# EAGLE schematic USB-C PD (EAGLE 9.2.1)
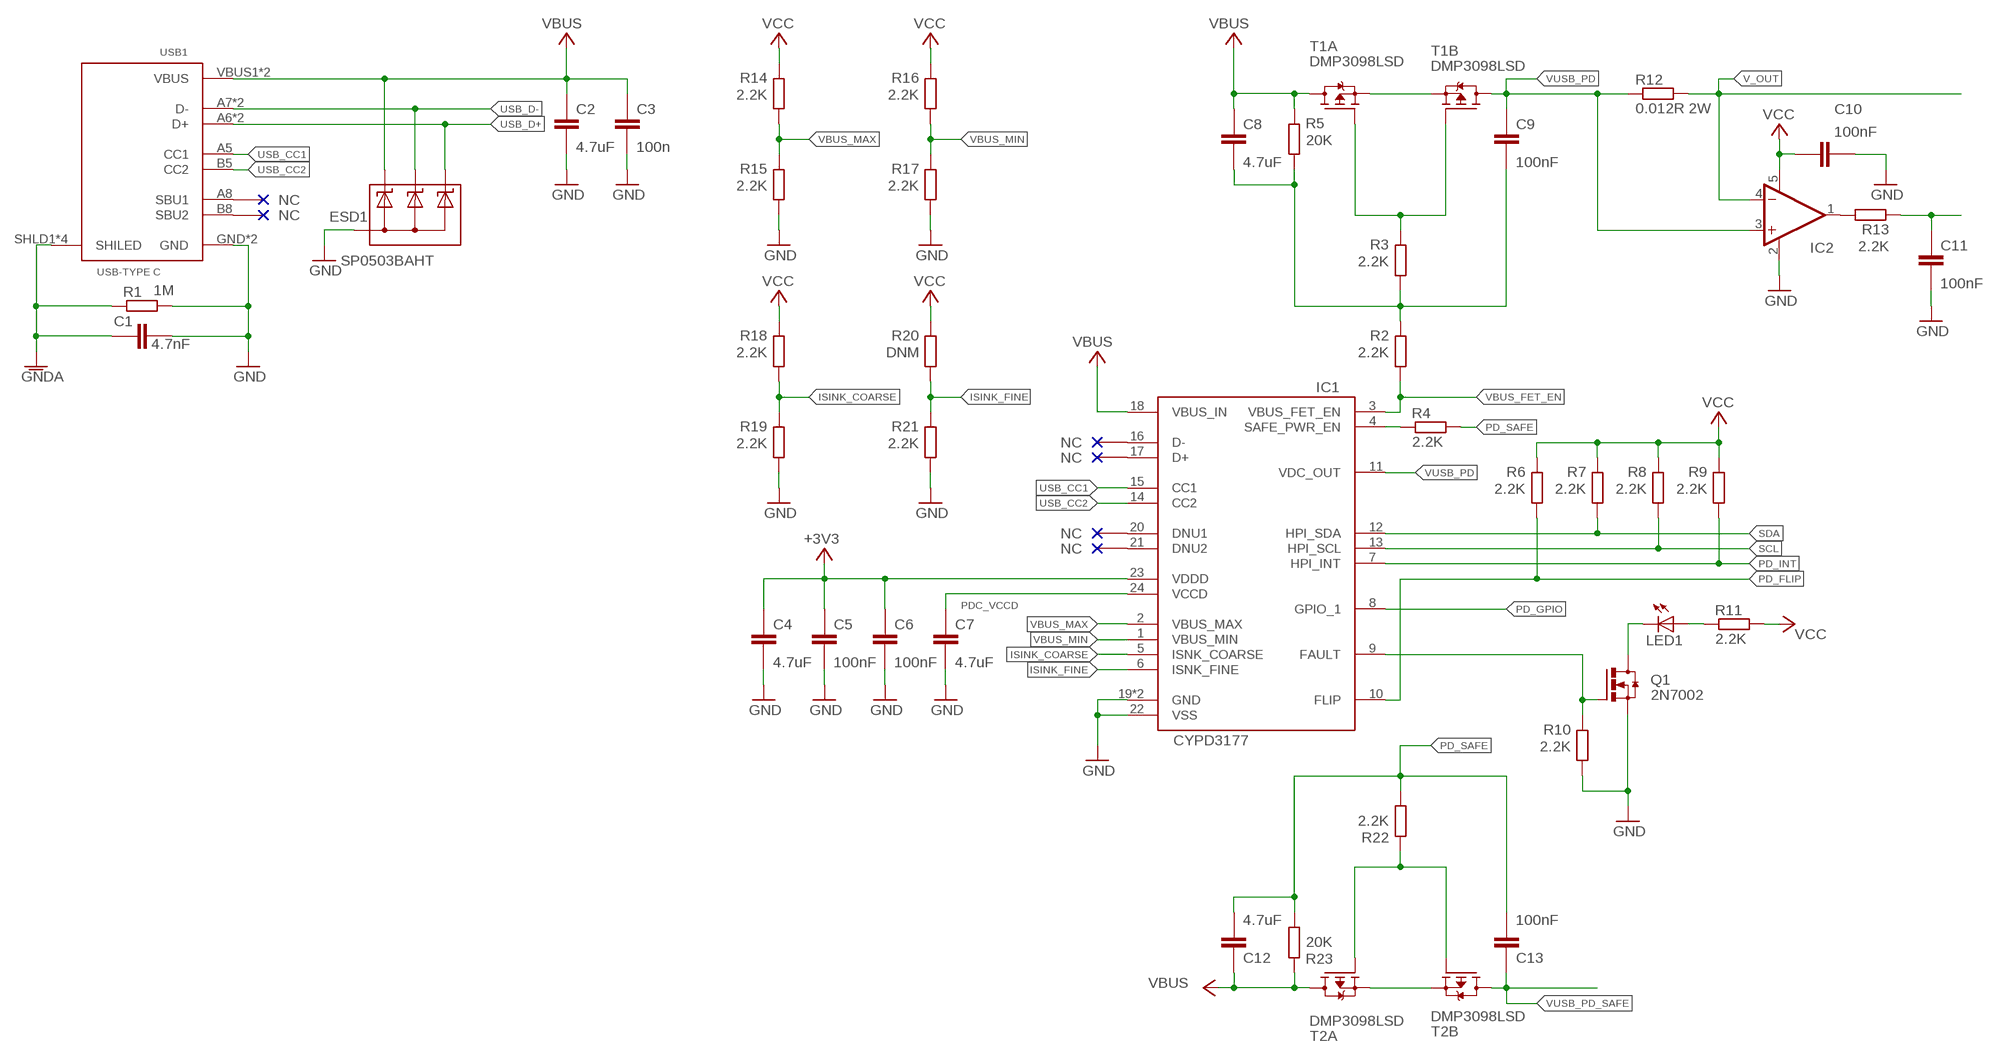
[diagram p0: schematic, sheet 1]

## Parts
C1  4.7nF  C0402  [0402]
C2  4.7uF  C0603  [0603]
C3  100n  C0603  [0603]
C4  4.7uF  C0603  [0603]
C5  100nF  C0402  [0402]
C6  100nF  C0402  [0402]
C7  4.7uF  C0603  [0603]
C8  4.7uF  C0603  [0603]
C9  100nF  C0402  [0402]
C10  100nF  C0402  [0402]
C11  100nF  C0402  [0402]
C12  4.7uF  C0603  [0603]
C13  100nF  C0402  [0402]
ESD1  SP0503BAHT  [SOT143]
IC1  CYPD3177-24LQXQ  [QFN50P400X400X60-25T275N]
IC2  INA180A3-IDBVR  [SOT23-5]
LED1  LEDCHIP-LED0805  [CHIP-LED0805]
Q1  2N7002  2N7002,215  [SOT23-3]
R1  1M  R0402  [0402]
R2  2.2K  R0402  [0402]
R3  2.2K  R0402  [0402]
R4  2.2K  R0402  [0402]
R5  20K  R0402  [0402]
R6  2.2K  R0402  [0402]
R7  2.2K  R0402  [0402]
R8  2.2K  R0402  [0402]
R9  2.2K  R0402  [0402]
R10  2.2K  R0402  [0402]
R11  2.2K  R0402  [0402]
R12  0.012R 2W  R-EU_R2512  [R2512]
R13  2.2K  R0402  [0402]
R14  2.2K  R0402  [0402]
R15  2.2K  R0402  [0402]
R16  2.2K  R0402  [0402]
R17  2.2K  R0402  [0402]
R18  2.2K  R0402  [0402]
R19  2.2K  R0402  [0402]
R20  DNM  R0402  [0402]
R21  2.2K  R0402  [0402]
R22  2.2K  R0402  [0402]
R23  20K  R0402  [0402]
T1  DMP3098LSD  DMP3098-LSD-13  [SO8]
T2  DMP3098LSD  DMP3098-LSD-13  [SO8]
USB1  USB_C  [USBC]

## Nets
+3V3: C4.1 C5.1 C6.1 IC1.23(VDDD)
GND: C1.1 C2.2 C3.2 C4.2 C5.2 C6.2 C7.2 C10.2 C11.2 ESD1.1(A) IC1.19(GND) IC1.22(VSS) IC1.25(GND) IC2.2(V-) Q1.2(S) R1.1 R10.1 R15.1 R17.1 R19.1 R21.1 USB1.GND USB1.GND2(GND)
GNDA: C1.2 R1.2 USB1.SHLD1(SHILED) USB1.SHLD2(SHILED) USB1.SHLD5(SHILED) USB1.SHLD8(SHILED)
ISINK_COARSE: IC1.5(ISNK_COARSE) R18.1 R19.2
ISINK_FINE: IC1.6(ISNK_FINE) R20.1 R21.2
N$1: R3.2 T1.2(A:G) T1.4(B:G)
N$2: IC1.4(SAFE_PWR_EN) R4.1
N$3: IC2.1(OUT) R13.2
N$4: C8.2 C9.2 R2.2 R3.1 R5.1
N$5 [Power]: T1.1(A:S) T1.3(B:S)
N$6: C11.1 R13.1
N$7: IC1.9(FAULT) Q1.1(G) R10.2
N$8: LED1.A R11.2
N$9: LED1.C Q1.3(D)
N$11: R22.2 T2.2(A:G) T2.4(B:G)
N$12 [Power]: T2.1(A:S) T2.3(B:S)
PD_FLIP: IC1.10(FLIP) R6.1
PD_GPIO: IC1.8(GPIO_1)
PD_INT: IC1.7(HPI_INT) R9.1
PD_SAFE: C12.2 C13.2 R4.2 R22.1 R23.1
PDC_VCCD: C7.1 IC1.24(VCCD)
SCL: IC1.13(HPI_SCL) R8.1
SDA: IC1.12(HPI_SDA) R7.1
USB_CC1: IC1.15(CC1) USB1.A5(CC1)
USB_CC2: IC1.14(CC2) USB1.B5(CC2)
USB_D+: ESD1.4(C3) USB1.A6(D+) USB1.B6(D+)
USB_D-: ESD1.3(C2) USB1.A7(D-) USB1.B7(D-)
V_OUT [Power]: IC2.4(-IN) R12.2
VBUS [Power]: C2.1 C3.1 C8.1 C12.1 ESD1.2(C1) IC1.18(VBUS_IN) R5.2 R23.2 T1.7(A:D) T1.8(A:D) T2.7(A:D) T2.8(A:D) USB1.VBUS1(VBUS) USB1.VBUS2(VBUS)
VBUS_FET_EN: IC1.3(VBUS_FET_EN) R2.1
VBUS_MAX: IC1.2(VBUS_MAX) R14.1 R15.2
VBUS_MIN: IC1.1(VBUS_MIN) R16.1 R17.2
VCC: C10.1 IC2.5(V+) R6.2 R7.2 R8.2 R9.2 R11.1 R14.2 R16.2 R18.2 R20.2
VUSB_PD [Power]: C9.1 IC1.11(VDC_OUT) IC2.3(+IN) R12.1 T1.5(B:D) T1.6(B:D)
VUSB_PD_SAFE [Power]: C13.1 T2.5(B:D) T2.6(B:D)
Unconnected: IC1.16(D-) IC1.17(D+) IC1.20(DNU1) IC1.21(DNU2) USB1.A8(SBU1) USB1.B8(SBU2)

## Library data of the parts
C1-C13 = ds_passive:C
ESD1 = ds_ic_peripherals:SP0503BAHT: TVS Diode Arrays Surface Mount TVS Avalanche Diode Array
IC1 = ds_ic_vreg:CYPD3177: USB Type-C Port Controller for Power Sinks EZ-PD™ BCR is Cypress’ highly-integrated pre-programmed USB Type-C port controller targeting electronic devices that have legacy barrel connectors (up to 100W) or USB micro-B connectors for power such as drones, smart speakers, power tools, and other rechargeable devices. EZ-PD BCR complies with the latest USB Type-C and USB Power Delivery (PD) standards and enables users to quickly convert their devices from being powered through a barrel connector to being powered via the USB-C connector with few external components and no firmware development is required. EZ-PD BCR integrates a complete USB Type-C transceiver, USB PD policy manager, a load switch controller with a soft start, all termination resistors required for a USB Type-C port, and system-level ESD protection. It is available in a 24-pin QFN package.
IC2 = ds_ic_peripherals:INA180: INAx180 Low- and High-Side Voltage Output, Current-Sense Amplifiers
LED1 = led:LED: LED OSRAM: - CHIPLED LG R971, LG N971, LY N971, LG Q971, LY Q971, LO R971, LY R971 LH N974, LH R974 LS Q976, LO Q976, LY Q976 LO Q996 - Hyper CHIPLED LW Q18S LB Q993, LB Q99A, LB R99A - SideLED LS A670, LO A670, LY A670, LG A670, LP A670 LB A673, LV A673, LT A673, LW A673 LH A674 LY A675 LS A676, LA A676, LO A676, LY A676, LW A676 LS A679, LY A679, LG A679 - Hyper Micro SIDELED® LS Y876, LA Y876, LO Y876, LY Y876 LT Y87S - SmartLED LW L88C, LW L88S LB L89C, LB L89S, LG L890 LS L89K, LO L89K, LY L89K LS L896, LA L896, LO L896, LY L896 - TOPLED LS T670, LO T670, LY T670, LG T670, LP T670 LSG T670, LSP T670, LSY T670, LOP T670, LYG T670 LG T671, LOG T671, LSG T671 LB T673, LV T673, LT T673, LW T673 LH T674 LS T676, LA T676, LO T676, LY T676, LB T676, LH T676, LSB T676, LW T676 LB T67C, LV T67C, LT T67C, LS T67K, LO T67K, LY T67K, LW E67C LS E67B, LA E67B, LO E67B, LY E67B, LB E67C, LV E67C, LT E67C LW T67C LS T679, LY T679, LG T679 LS T770, LO T770, LY T770, LG T770, LP T770 LB T773, LV T773, LT T773, LW T773 LH T774 LS E675, LA E675, LY E675, LS T675 LS T776, LA T776, LO T776, LY T776, LB T776 LHGB T686 LT T68C, LB T68C - Hyper Mini TOPLED® LB M676 - Mini TOPLED Santana® LG M470 LS M47K, LO M47K, LY M47K Source: http://www.osram.convergy.de LUXEON: - LUMILED® LXK2-PW12-R00, LXK2-PW12-S00, LXK2-PW14-U00, LXK2-PW14-V00 LXK2-PM12-R00, LXK2-PM12-S00, LXK2-PM14-U00 LXK2-PE12-Q00, LXK2-PE12-R00, LXK2-PE12-S00, LXK2-PE14-T00, LXK2-PE14-U00 LXK2-PB12-K00, LXK2-PB12-L00, LXK2-PB12-M00, LXK2-PB14-N00, LXK2-PB14-P00, LXK2-PB14-Q00 LXK2-PR12-L00, LXK2-PR12-M00, LXK2-PR14-Q00, LXK2-PR14-R00 LXK2-PD12-Q00, LXK2-PD12-R00, LXK2-PD12-S00 LXK2-PH12-R00, LXK2-PH12-S00 LXK2-PL12-P00, LXK2-PL12-Q00, LXK2-PL12-R00 Source: www.luxeon.com KINGBRIGHT: KA-3528ASYC Source: www.kingbright.com
Q1 = Transistor:2N7002,215: MOSFET N-CH 60V 300MA SOT-23 Manufacturer's datasheet <https://assets.nexperia.com/documents/data-sheet/2N7002.pdf>; CREATED_BY: PCBLayout.com; DIGIKEY_PART_NUMBER: 1727-2764-1-ND; MANUFACTURER: Nexperia USA Inc.; MPN: 2N7002,215; PACKAGE: SOT-23-3
R1-R11 R13-R23 = ds_passive:R
R12 = rcl:R-EU_: RESISTOR, European symbol; SPICEPREFIX: R
T1 T2 = ds_active:DMP3098: DUAL P-CHANNEL ENHANCEMENT MODE MOSFET
USB1 = ds_con:USB_C

## Net classes
1 Power: width 3 mm